# Altium schematic sheet battery_protect.SchDoc
size 297 x 209 mm
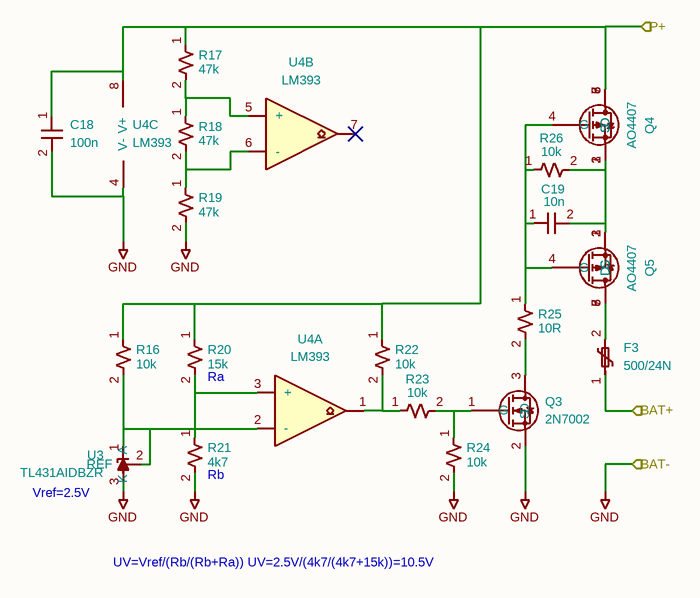
[diagram p0: battery_protect.SchDoc]

## Parts
C18  100n  [C_0603_1608Metric]
C19  10n  [C_0603_1608Metric]
F3  500/24N  [Fuse_2920_7451Metric]
Q3  2N7002  [SOT-23]
Q4  AO4407  [SOP-8_3.9x4.9mm_P1.27mm]
Q5  AO4407  [SOP-8_3.9x4.9mm_P1.27mm]
R16  10k  [R_0603_1608Metric]
R17  47k  [R_0603_1608Metric]
R18  47k  [R_0603_1608Metric]
R19  47k  [R_0603_1608Metric]
R20  15k  [R_0603_1608Metric]
R21  4k7  [R_0603_1608Metric]
R22  10k  [R_0603_1608Metric]
R23  10k  [R_0603_1608Metric]
R24  10k  [R_0603_1608Metric]
R25  10R  [R_0603_1608Metric]
R26  10k  [R_0603_1608Metric]
U3  TL431AIDBZR  [SOT-23]
U4  LM393  [SOIC-8_3.9x4.9mm_P1.27mm]  (parts A,B,C of 3)

## Ports
BAT+ (in), BAT- (in), P+ (in)

## Nets
GND: C18.2 Q3.2(S) R19.2 R21.2 R24.2 U3.3(A) U4.4(V-) ; port BAT-
BAT+: F3.1 ; port BAT+
P+: C18.1 Q4.5(D) Q4.6(D) Q4.7(D) Q4.8(D) R16.1 R17.1 R20.1 R22.1 U4.8(V+) ; port P+
NetC19_1: C19.1 Q4.4(G) Q5.4(G) R25.1 R26.1
NetC19_2: C19.2 Q4.1(S) Q4.2(S) Q4.3(S) Q5.1(S) Q5.2(S) Q5.3(S) R26.2
NetF3_2: F3.2 Q5.5(D) Q5.6(D) Q5.7(D) Q5.8(D)
NetQ3_1: Q3.1(G) R23.2 R24.1
NetQ3_3: Q3.3(D) R25.2
NetR16_2: R16.2 U3.1(K) U3.2(REF) U4.2(-)
NetR17_2: R17.2 R18.1 U4.5(+)
NetR18_2: R18.2 R19.1 U4.6(-)
NetR20_2: R20.2 R21.1 U4.3(+)
NetR22_2: R22.2 R23.1 U4.1

Not connected (* = marked no-connect by the designer): U4 7*

## Notes on the sheet
- (near R20) Ra
- (near R21) Rb
- (near U3) Vref=2.5V
- UV=Vref/(Rb/(Rb+Ra))
  UV=2.5V/(4k7/(4k7+15k))=10.5V
- 1
- 2
- 3
- 4
- 5
- 6
- A
- B
- C
- D
- Title: UPS Lead Acid
- File: battery_protect.kicad_sch
- Sheet: /
- Electgpl
- KiCad E.D.A.  kicad (5.1.4)-1
- Size: A4
- Date: 2025-06-05
- Rev: 1.0
- Id: 1/1

## Library data of the parts
C18 = C_Small: MFR P/N: CL10B104KB8NNNC; Description: Unpolarized capacitor, small symbol; LCSC: C1591; Value: 100n; Footprint: Capacitor_SMD:C_0603_1608Metric
C19 = C_Small: MFR P/N: CL10B103KB8NNNC; Description: Unpolarized capacitor, small symbol; LCSC: C1589; Value: 10n; Footprint: Capacitor_SMD:C_0603_1608Metric
F3 = Polyfuse_Small: MFR P/N: SMD2920-500/24N; Description: 24V 5A 40A 10A 2920 Resettable Fuses ROHS; Absolute minimum: 16V 3A; Reference MFG P/N: C6165172; LCSC: C6165172; Value: 500/24N; Footprint: Fuse:Fuse_2920_7451Metric
Q3 = 2N7002: MFR P/N: 2N7002,215; Description: 0.115A Id, 60V Vds, N-Channel MOSFET, SOT-23; LCSC: C65189; Value: 2N7002; Footprint: Package_TO_SOT_SMD:SOT-23
Q4 Q5 = IRF7404: MFR P/N: AO4407A; Description: -6.7A Id, -20V Vds, P-Channel HEXFET Power MOSFET, SO-8; LCSC: C2841482; Value: AO4407; Footprint: Package_SO:SOP-8_3.9x4.9mm_P1.27mm
R16 R22-R24 R26 = R_Small_US: MFR P/N: FRC0603J103 TS; Description: Resistor, small US symbol; LCSC: C2930027; Value: 10k; Footprint: Resistor_SMD:R_0603_1608Metric
R17-R19 = R_Small_US: MFR P/N: FRC0603F4702TS; Description: Resistor, small US symbol; LCSC: C2907042; Value: 47k; Footprint: Resistor_SMD:R_0603_1608Metric
R20 = R_Small_US: MFR P/N: FRC0603F1502TS; Description: Resistor, small US symbol; LCSC: C2906995; Value: 15k; Footprint: Resistor_SMD:R_0603_1608Metric
R21 = R_Small_US: MFR P/N: FRC0603J472 TS; Description: Resistor, small US symbol; LCSC: C2907166; Value: 4k7; Footprint: Resistor_SMD:R_0603_1608Metric
R25 = R_Small_US: MFR P/N: FRC0603J100 TS; Description: Resistor, small US symbol; LCSC: C2907091; Value: 10R; Footprint: Resistor_SMD:R_0603_1608Metric
U3 = TL431DBZ: Description: Shunt Regulator, SOT-23; LCSC: C23892; MFR P/N: TL431AIDBZR; Value: TL431AIDBZR; Footprint: Package_TO_SOT_SMD:SOT-23
U4 = LM393: MFR P/N: LM393DR; Description: Low-Power, Low-Offset Voltage, Dual Comparators, DIP-8/SOIC-8/TO-99-8; LCSC: C67470; Value: LM393; Footprint: Package_SO:SOIC-8_3.9x4.9mm_P1.27mm